# EAGLE schematic topshell2.1 (EAGLE 9.3.0)
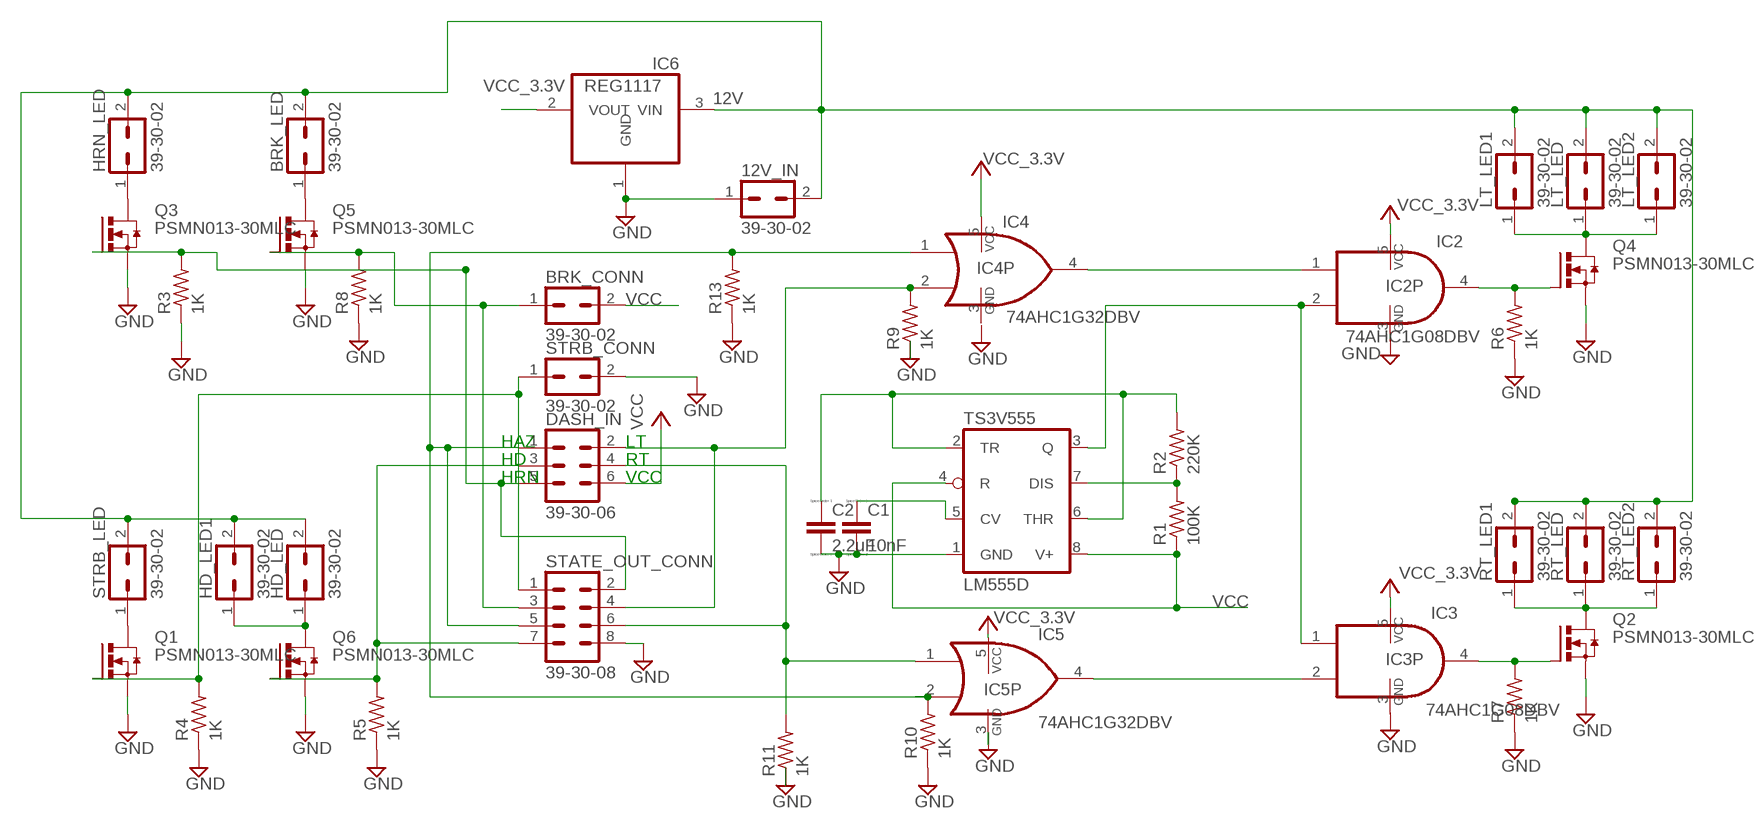
[diagram p0: schematic, sheet 1]

## Parts
12V_IN  39-30-02  [39-30-?02?]
BRK_CONN  39-30-02  [39-30-?02?]
BRK_LED  39-30-02  [39-30-?02?]
C1  10nF  C  [C0805]
C2  2.2uF  C  [C0805]
DASH_IN  39-30-06  [39-30-?06?]
HD_LED  39-30-02  [39-30-?02?]
HD_LED1  39-30-02  [39-30-?02?]
HRN_LED  39-30-02  [39-30-?02?]
IC2  74AHC1G08DBV  [SOT23-5]
IC3  74AHC1G08DBV  [SOT23-5]
IC4  74AHC1G32DBV  [SOT23-5]
IC5  74AHC1G32DBV  [SOT23-5]
IC6  REG1117  [SOT223]
LT_LED  39-30-02  [39-30-?02?]
LT_LED1  39-30-02  [39-30-?02?]
LT_LED2  39-30-02  [39-30-?02?]
Q1  PSMN013-30MLC  [LFPAK33]
Q2  PSMN013-30MLC  [LFPAK33]
Q3  PSMN013-30MLC  [LFPAK33]
Q4  PSMN013-30MLC  [LFPAK33]
Q5  PSMN013-30MLC  [LFPAK33]
Q6  PSMN013-30MLC  [LFPAK33]
R1  100K  R-US_R0805  [R0805]
R2  220K  R-US_R0805  [R0805]
R3  1K  R-US_R0805  [R0805]
R4  1K  R-US_R0805  [R0805]
R5  1K  R-US_R0805  [R0805]
R6  1K  R-US_R0805  [R0805]
R7  1K  R-US_R0805  [R0805]
R8  1K  R-US_R0805  [R0805]
R9  1K  R-US_R0805  [R0805]
R10  1K  R-US_R0805  [R0805]
R11  1K  R-US_R0805  [R0805]
R13  1K  R-US_R0805  [R0805]
RT_LED  39-30-02  [39-30-?02?]
RT_LED1  39-30-02  [39-30-?02?]
RT_LED2  39-30-02  [39-30-?02?]
STATE_OUT_CONN  39-30-08  [39-30-?08?]
STRB_CONN  39-30-02  [39-30-?02?]
STRB_LED  39-30-02  [39-30-?02?]
TS3V555  LM555D  [SO08]

## Nets
12V: 12V_IN.2 BRK_LED.2 HD_LED1.2 HD_LED.2 HRN_LED.2 IC6.3(VIN) LT_LED1.2 LT_LED2.2 LT_LED.2 RT_LED1.2 RT_LED2.2 RT_LED.2 STRB_LED.2
GND: 12V_IN.1 C1.2 C2.2 IC5.3(GND) IC6.1(GND) Q1.1(S) Q1.2(S) Q1.3(S) Q2.1(S) Q2.2(S) Q2.3(S) Q3.1(S) Q3.2(S) Q3.3(S) Q4.1(S) Q4.2(S) Q4.3(S) Q5.1(S) Q5.2(S) Q5.3(S) Q6.1(S) Q6.2(S) Q6.3(S) R3.1 R4.1 R5.1 R6.1 R7.1 R8.1 R9.1 R10.1 R11.1 R13.1 STATE_OUT_CONN.8 STRB_CONN.2 TS3V555.1(GND)
N$1: R1.2 R2.1 TS3V555.7(DIS)
N$2: Q1.MB(D) STRB_LED.1
N$3: C2.1 R2.2 TS3V555.2(TR) TS3V555.6(THR)
N$4: IC2.2(I1) IC3.1(I0) TS3V555.3(Q)
N$5: HRN_LED.1 Q3.MB(D)
N$6: Q1.4(G) R4.2 STATE_OUT_CONN.1 STRB_CONN.1
N$7: DASH_IN.2 IC4.2(I1) R9.2 STATE_OUT_CONN.4
N$8: DASH_IN.1 IC4.1(I0) IC5.2(I1) R10.2 R13.2 STATE_OUT_CONN.5
N$9: IC2.1(I0) IC4.4(O)
N$10: IC3.2(I1) IC5.4(O)
N$11: DASH_IN.4 IC5.1(I0) R11.2 STATE_OUT_CONN.6
N$12: IC2.4(O) Q4.4(G) R6.2
N$13: IC3.4(O) Q2.4(G) R7.2
N$14: LT_LED1.1 LT_LED2.1 LT_LED.1 Q4.MB(D)
N$15: Q2.MB(D) RT_LED1.1 RT_LED2.1 RT_LED.1
N$16: BRK_LED.1 Q5.MB(D)
N$17: HD_LED1.1 HD_LED.1 Q6.MB(D)
N$19: DASH_IN.3 Q6.4(G) R5.2 STATE_OUT_CONN.7
N$20: DASH_IN.5 Q3.4(G) R3.2 STATE_OUT_CONN.2
N$23: BRK_CONN.1 Q5.4(G) R8.2 STATE_OUT_CONN.3
TS3V555: C1.1 TS3V555.5(CV)
VCC: BRK_CONN.2 DASH_IN.6 R1.1 TS3V555.4(R) TS3V555.8(V+)
VCC_3.3V: IC2.5(VCC) IC3.5(VCC) IC4.5(VCC) IC5.5(VCC) IC6.2(VOUT) ; supply symbol labelled VCC

## Notes on the sheet
- HAZ | LT
- HD | RT
- HRN | VCC

## Power pins joined to a net without a drawn wire
GND: IC2.3(GND) IC3.3(GND) IC4.3(GND)

## Library data of the parts
12V_IN BRK_CONN BRK_LED HD_LED HD_LED1 HRN_LED LT_LED LT_LED1 LT_LED2 RT_LED RT_LED1 RT_LED2 STRB_CONN STRB_LED = con-molex-mini-fit:39-30-?02?: HEADER
C1 C2 = eagle-ltspice:C: CAPACITOR, European symbol; SPICEMODEL: NONE; SPICEPREFIX: C
DASH_IN = con-molex-mini-fit:39-30-?06?: HEADER
IC2 IC3 = 74xx-little-us:74*1G08: 2-input AND gate
IC4 IC5 = 74xx-little-us:74*1G32: 2-input OR gate
IC6 = burr-brown:REG1117: 800mA and 1A Low Dropout (LDO) Positive Regulator 1.8V, 2.5V, 2.85V, 3.3V, 5V, and Adj; MPN: REG1117; OC_FARNELL: 1097566; OC_NEWARK: 14P6981
Q1-Q6 = transistor-power:PSMN013-30MLC: N-channel 30 V 13.6 mΩ logic level MOSFET NextPower Technology Source: Data sheet <http://www.nxp.com/documents/data_sheet/PSMN013-30MLC.pdf> PSMN013-30MLC © NXP B.V. 2012. All rights reserved.; MPN: PSMN013-30MLC; OC_FARNELL: 2115260; OC_NEWARK: 05W5709
R1-R11 R13 = rcl:R-US_: RESISTOR, American symbol
STATE_OUT_CONN = con-molex-mini-fit:39-30-?08?: HEADER
TS3V555 = linear:*555: TIMER